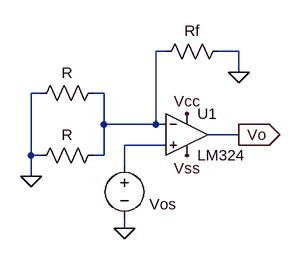
[diagram p0: schematic Circuito Error CC Vos.asc]
Circuito Error CC Vos.asc, the LTspice schematic file:
Version 4
SHEET 1 1560 680
WIRE 464 -240 448 -240
WIRE 576 -240 544 -240
WIRE 576 -208 576 -240
WIRE 272 -176 256 -176
WIRE 368 -176 352 -176
WIRE 368 -128 368 -176
WIRE 448 -128 448 -240
WIRE 448 -128 368 -128
WIRE 464 -128 448 -128
WIRE 576 -112 528 -112
WIRE 464 -96 400 -96
WIRE 256 -80 256 -176
WIRE 272 -80 256 -80
WIRE 368 -80 368 -128
WIRE 368 -80 352 -80
WIRE 400 -64 400 -96
WIRE 256 -48 256 -80
WIRE 400 32 400 16
FLAG 400 32 0
FLAG 496 -144 Vcc
FLAG 496 -80 Vss
FLAG 576 -112 Vo
IOPIN 576 -112 Out
FLAG 256 -48 0
FLAG 576 -208 0
SYMBOL OpAmps\\opamp2 496 -176 R0
SYMATTR InstName U1
SYMATTR Value LM324
SYMBOL res 256 -160 R270
WINDOW 0 32 56 VTop 2
WINDOW 3 0 56 VBottom 2
SYMATTR InstName R
SYMATTR Value ""
SYMBOL res 256 -64 R270
WINDOW 0 32 56 VTop 2
WINDOW 3 0 56 VBottom 2
SYMATTR InstName R
SYMATTR Value ""
SYMBOL res 560 -256 R90
WINDOW 0 0 56 VBottom 2
WINDOW 3 32 56 VTop 2
SYMATTR InstName Rf
SYMATTR Value ""
SYMBOL voltage 400 -80 R0
WINDOW 0 38 75 Left 2
SYMATTR InstName Vos
SYMATTR Value ""

The netlist it stands for:
* Circuito Error CC Vos.asc
XU1 N002 N001 Vcc Vss Vo LM324  ; pins In+ In- V+ V- OUT
R 0 N001
R 0 N001
Rf 0 N001
Vos N002 0
.backanno
.end